# EAGLE design SuperAli (EAGLE 7.2.0)
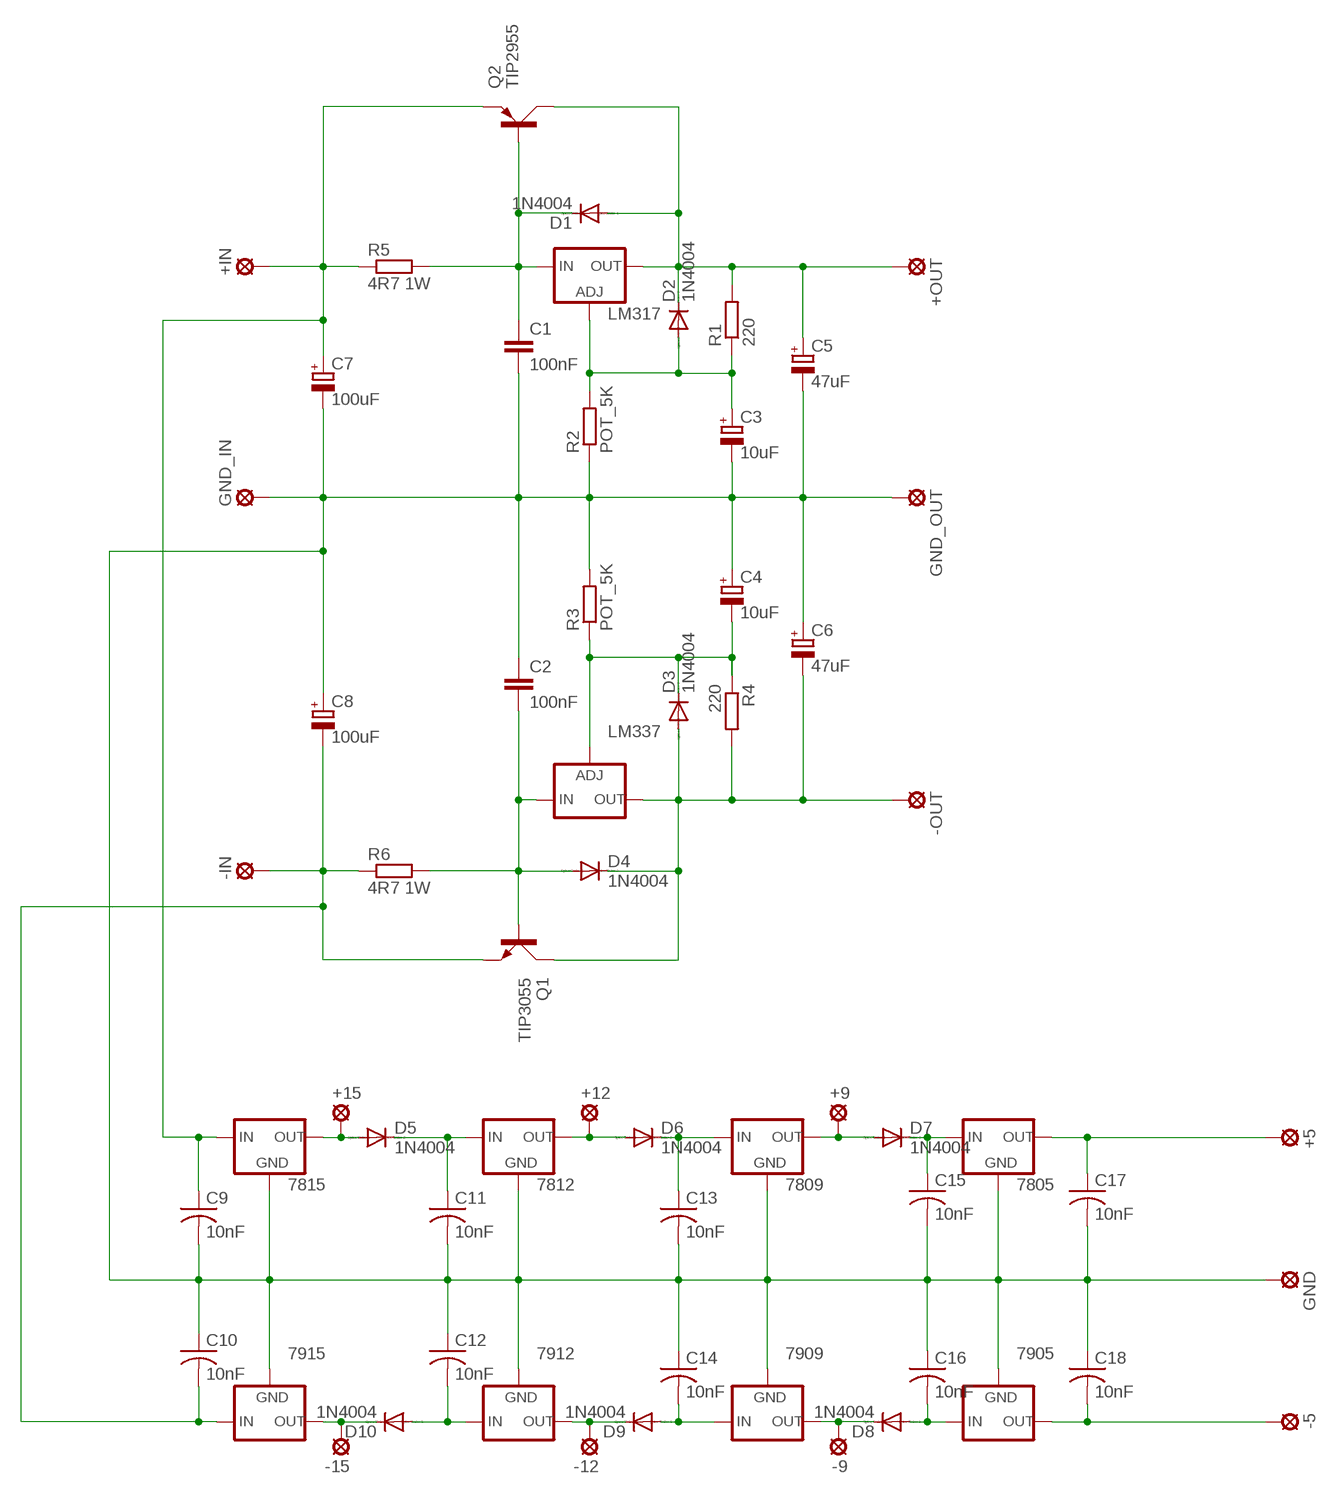
[diagram p0: schematic, sheet 1]

## Parts
7805  78XXS  [78XXS]
7809  78XXS  [78XXS]
7812  78XXS  [78XXS]
7815  78XXS  [78XXS]
7905  79XXS  [79XXS]
7909  79XXS  [79XXS]
7912  79XXS  [79XXS]
7915  79XXS  [79XXS]
+5  LSP10  [LSP10]
+9  LSP10  [LSP10]
+12  LSP10  [LSP10]
+15  LSP10  [LSP10]
+IN  LSP13  [LSP13]
+OUT  LSP13  [LSP13]
-5  LSP10  [LSP10]
-9  LSP10  [LSP10]
-12  LSP10  [LSP10]
-15  LSP10  [LSP10]
-IN  LSP13  [LSP13]
-OUT  LSP13  [LSP13]
C1  100nF  C-EU025-040X050  [C025-040X050]
C2  100nF  C-EU025-040X050  [C025-040X050]
C3  10uF  CPOL-EUE2-5  [E2-5]
C4  10uF  CPOL-EUE2-5  [E2-5]
C5  47uF  CPOL-EUE3.5-10  [E3,5-10]
C6  47uF  CPOL-EUE3.5-10  [E3,5-10]
C7  100uF  CPOL-EUE7.5-16  [E7,5-16]
C8  100uF  CPOL-EUE7.5-16  [E7,5-16]
C9  10nF  C-US025-025X050  [C025-025X050]
C10  10nF  C-US025-025X050  [C025-025X050]
C11  10nF  C-US025-025X050  [C025-025X050]
C12  10nF  C-US025-025X050  [C025-025X050]
C13  10nF  C-US025-025X050  [C025-025X050]
C14  10nF  C-US025-025X050  [C025-025X050]
C15  10nF  C-US025-025X050  [C025-025X050]
C16  10nF  C-US025-025X050  [C025-025X050]
C17  10nF  C-US025-025X050  [C025-025X050]
C18  10nF  C-US025-025X050  [C025-025X050]
D1  1N4004  [DO41-10]
D2  1N4004  [DO41-10]
D3  1N4004  [DO41-10]
D4  1N4004  [DO41-10]
D5  1N4004  [DO41-10]
D6  1N4004  [DO41-10]
D7  1N4004  [DO41-10]
D8  1N4004  [DO41-10]
D9  1N4004  [DO41-10]
D10  1N4004  [DO41-10]
GND  LSP10  [LSP10]
GND_IN  LSP13  [LSP13]
GND_OUT  LSP13  [LSP13]
LM317  LM317TS  [317TS]
LM337  LM337TS  [337TS]
Q1  TIP3055  [TOP3AV]
Q2  TIP2955  [TOP3AV]
R1  220  R-EU_0207/7  [0207/7]
R2  POT_5K  R-EU_0207/7  [0207/7]
R3  POT_5K  R-EU_0207/7  [0207/7]
R4  220  R-EU_0207/7  [0207/7]
R5  4R7 1W  R-EU_0617/17  [0617/17]
R6  4R7 1W  R-EU_0617/17  [0617/17]

## Nets
7809: 7809.OUT +9.MP D7.A
N$2: C3.+ D2.A LM317.1(ADJ) R1.1 R2.2
N$3: C2.2 D4.A LM337.2(IN) Q1.B R6.2
N$4: C4.- D3.C LM337.1(ADJ) R3.1 R4.1
N$5: C1.1 D1.C LM317.3(IN) Q2.B R5.2
N$6: -OUT.MP C6.- D3.A D4.C LM337.3(OUT) Q1.C R4.2
N$7: 7815.IN +IN.MP C7.+ C9.1 Q2.E R5.1
N$8: 7805.GND 7809.GND 7812.GND 7815.GND 7905.GND 7909.GND 7912.GND 7915.GND C1.2 C2.1 C3.- C4.+ C5.- C6.+ C7.- C8.+ C9.2 C10.1 C11.2 C12.1 C13.2 C14.1 C15.2 C16.1 C17.2 C18.1 GND.MP GND_IN.MP GND_OUT.MP R2.1 R3.2
N$9: 7915.IN -IN.MP C8.- C10.2 Q1.E R6.1
N$10: +OUT.MP C5.+ D1.A D2.C LM317.2(OUT) Q2.C R1.2
N$14: 7805.OUT +5.MP C17.1
N$15: 7905.OUT -5.MP C18.2
N$16: 7805.IN C15.1 D7.C
N$17: 7905.IN C16.2 D8.A
N$18: 7909.OUT -9.MP D8.C
N$20: 7809.IN C13.1 D6.C
N$21: 7909.IN C14.2 D9.A
N$22: 7912.OUT -12.MP D9.C
N$23: 7812.OUT +12.MP D6.A
N$24: 7812.IN C11.1 D5.C
N$25: 7815.OUT +15.MP D5.A
N$26: 7915.OUT -15.MP D10.C
N$27: 7912.IN C12.2 D10.A

## Library data of the parts
7805 7809 7812 7815 = v-reg:78XXS: VOLTAGE REGULATOR
7905 7909 7912 7915 = v-reg:79XXS: VOLTAGE REGULATOR
+5 +9 +12 +15 -5 -9 -12 -15 GND = solpad:LSP10: SOLDER PAD drill 1.0 mm, distributor Buerklin, 12H555
+IN +OUT -IN -OUT GND_IN GND_OUT = solpad:LSP13: SOLDER PAD drill 1.3 mm, distributor Buerklin, 12H562
C1 C2 = rcl:C-EU: CAPACITOR, European symbol
C3-C8 = rcl:CPOL-EU: POLARIZED CAPACITOR, European symbol
C9-C18 = rcl:C-US: CAPACITOR, American symbol
D1-D10 = diode:1N4004: DIODE general purpose rectifier, 1 A
LM317 = v-reg:LM317TS: VOLTAGE REGULATOR
LM337 = v-reg:LM337TS: VOLTAGE REGULATOR
Q1 = transistor-power:TIP3055: NPN TRANSISTOR
Q2 = transistor-power:TIP2955: PNP TRANSISTOR
R1-R6 = rcl:R-EU_: RESISTOR, European symbol

## Board
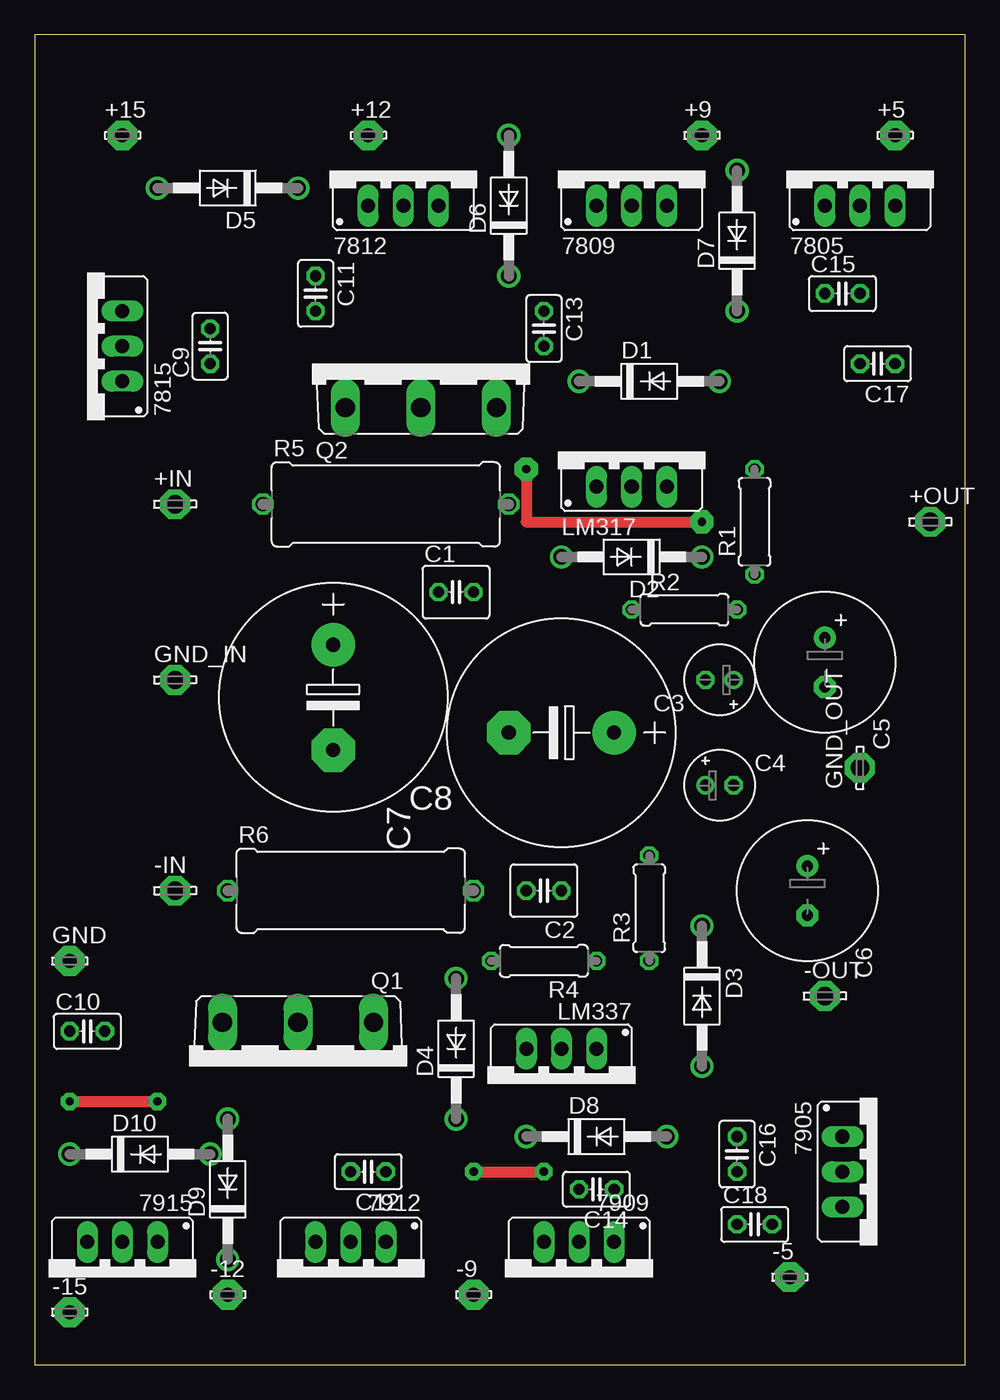
[diagram p1: board, top side]
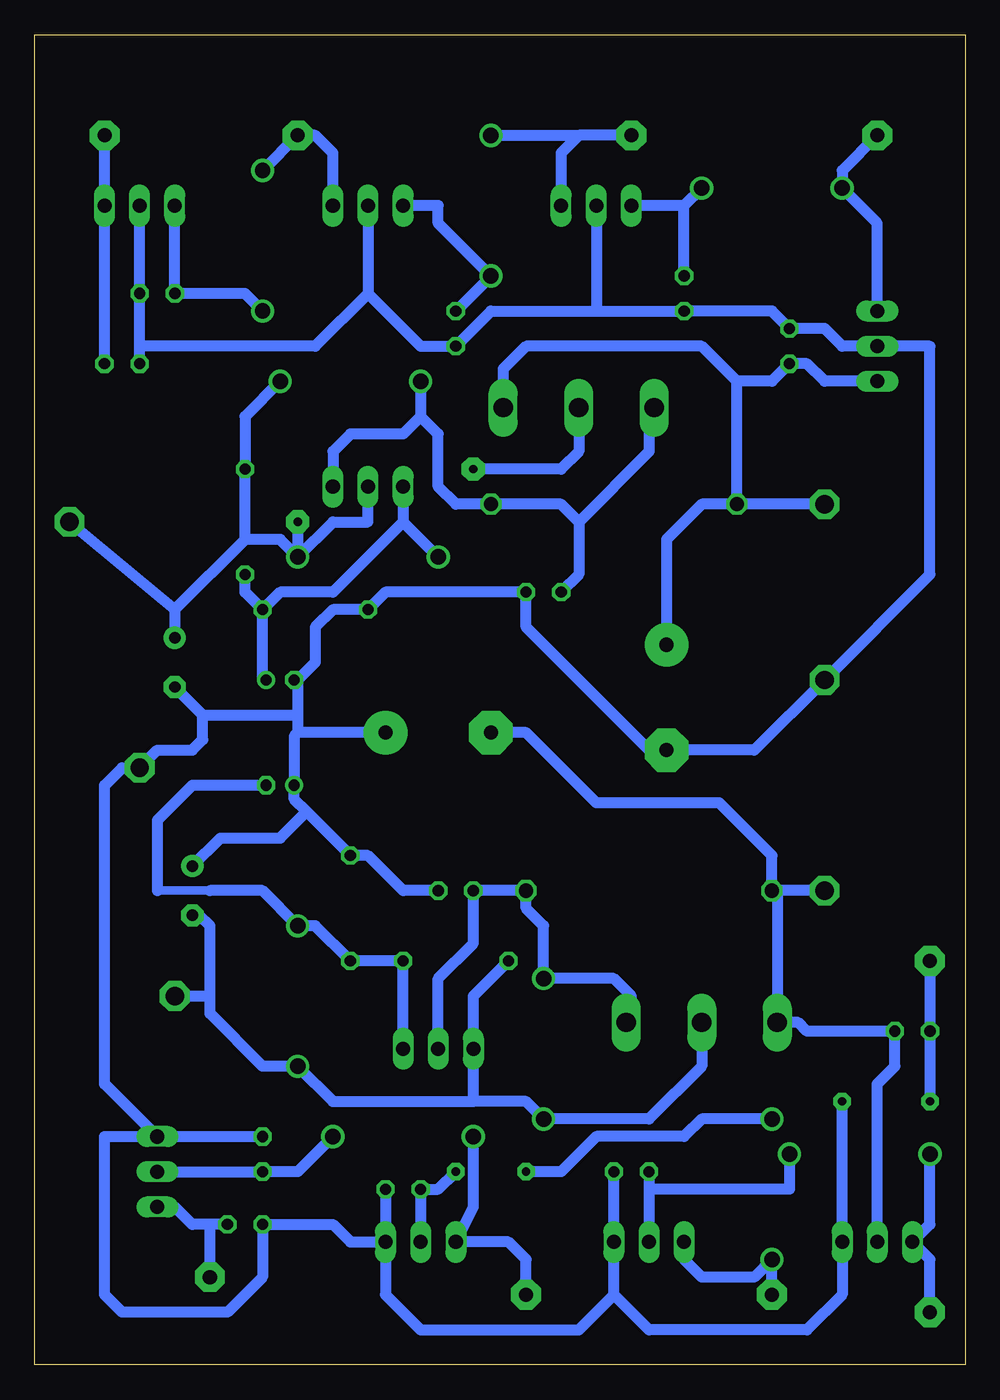
[diagram p2: board, bottom side, seen from below]

Size 67.29 x 96.19 mm. Coordinates in mm from the lower left corner, seen from the top.
Outline: 0,0 67.29,0 67.29,96.19 0,96.19 0,0
Copper layers (1*16): Top 0.035mm / dielectric 1.5mm / Bottom 0.035mm
Design rules "default": minimum track width 10mil, minimum drill 24mil, track to track 8mil, track to pad 8mil, pad to pad 8mil, via to via 8mil, smd to smd 8mil, copper to edge 40mil, drill to drill 8mil, minimum pad ring 10mil, minimum via ring 8mil, stop-mask expansion 4mil, vias tented up to drill 0mil, thermal gap 10mil

### Footprints (pad centres in the part's own frame; a part is rotated, then mirrored left to right if it is on the bottom)
78XXS = drill 1.016 long: GND 0,-2.54; IN -2.54,-2.54; OUT 2.54,-2.54
79XXS = drill 1.016 long: GND -2.54,-2.54; IN 0,-2.54; OUT 2.54,-2.54
LSP10 = drill 1.016 pad 2.159 octagon: MP 0,0
LSP13 = drill 1.321 pad 2.159 octagon: MP 0,0
C025-040X050 = drill 0.813 octagon: 1 -1.27,0; 2 1.27,0
E2-5 = drill 0.813 pad 1.27: + -1.016,0 | drill 0.813 pad 1.27 octagon: - 1.016,0
E3,5-10 = drill 0.813 pad 1.6: + -1.778,0 | drill 0.813 pad 1.6 octagon: - 1.778,0
E7,5-16 = drill 1.016 pad 3.15: + -3.81,0 | drill 1.016 pad 3.15 octagon: - 3.81,0
C025-025X050 = drill 0.813 octagon: 1 -1.27,0; 2 1.27,0
DO41-10 = drill 1.118: A 5.08,0; C -5.08,0
317TS = drill 1.016 long: 1 -2.54,-2.54; 2 0,-2.54; 3 2.54,-2.54
337TS = drill 1.016 long: 1 -2.54,-2.54; 2 0,-2.54; 3 2.54,-2.54
TOP3AV = drill 1.397 long: B -5.461,-3.175; C 0,-3.175; E 5.461,-3.175
0207/7 = drill 0.813 octagon: 1 -3.81,0; 2 3.81,0
0617/17 = drill 1.016 octagon: 1 -8.89,0; 2 8.89,0

### Placement (x,y rotation side)
7805  59.69,86.36 0 top
7809  43.18,86.36 0 top
7812  26.67,86.36 0 top
7815  3.81,73.66 90 top
7905  60.96,13.97 270 top
7909  39.37,6.35 180 top
7912  22.86,6.35 180 top
7915  6.35,6.35 180 top
+5  62.23,88.9 0 top
+9  48.26,88.9 0 top
+12  24.13,88.9 0 top
+15  6.35,88.9 0 top
+IN  10.16,62.23 0 top
+OUT  64.77,60.96 0 top
-5  54.61,6.35 0 top
-9  31.75,5.08 0 top
-12  13.97,5.08 0 top
-15  2.54,3.81 0 top
-IN  10.16,34.29 0 top
-OUT  57.15,26.67 0 top
C1  30.48,55.88 0 top
C2  36.83,34.29 180 top
C3  49.53,49.53 180 top
C4  49.53,41.91 0 top
C5  57.15,50.8 270 top
C6  55.88,34.29 270 top
C7  21.59,48.26 270 top
C8  38.1,45.72 180 top
C9  12.7,73.66 90 top
C10  3.81,24.13 0 top
C11  20.32,77.47 270 top
C12  24.13,13.97 180 top
C13  36.83,74.93 270 top
C14  40.64,12.7 180 top
C15  58.42,77.47 0 top
C16  50.8,15.24 270 top
C17  60.96,72.39 180 top
C18  52.07,10.16 0 top
D1  44.45,71.12 0 top
D2  43.18,58.42 180 top
D3  48.26,26.67 270 top
D4  30.48,22.86 90 top
D5  13.97,85.09 180 top
D6  34.29,83.82 90 top
D7  50.8,81.28 90 top
D8  40.64,16.51 0 top
D9  13.97,12.7 90 top
D10  7.62,15.24 0 top
GND  2.54,29.21 0 top
GND_IN  10.16,49.53 0 top
GND_OUT  59.69,43.18 90 top
LM317  43.18,66.04 0 top
LM337  38.1,20.32 180 top
Q1  19.05,21.59 180 top
Q2  27.94,72.39 0 top
R1  52.07,60.96 90 top
R2  46.99,54.61 0 top
R3  44.45,33.02 90 top
R4  36.83,29.21 180 top
R5  25.4,62.23 0 top
R6  22.86,34.29 0 top

### Tracks (layer width: path | path; a pad name or v marks a point on that pad's centre or on a via)
7809
  Bottom 0.813: D7.A +9.MP 46.99,88.9 45.72,87.63 7809.OUT
N$2
  Bottom 0.813: C3.+ 50.8,49.78 R2.2 | R2.2 52.07,55.88 R1.1 | D2.A 40.64,60.96 | LM317.1 40.64,60.96 | 40.64,60.96 45.72,55.88 49.53,55.88 R2.2
N$3
  Bottom 0.813: Q1.B 24.13,25.15 24.13,26.67 25.4,27.94 D4.A 30.48,31.75 31.75,33.02 R6.2 C2.2 35.56,30.48 38.1,27.94 LM337.2
N$4
  Bottom 0.61: 54.61,34.29 58.42,34.29
  Bottom 0.813: LM337.1 R4.1 R3.1 46.99,31.75 D3.C 50.8,34.29 54.61,34.29 | C4.- 55.88,41.91 58.42,39.37 58.42,34.29
N$5
  Bottom 0.813: Q2.B 22.86,68.83 22.86,66.04 27.94,60.96 | 27.94,60.96 27.94,57.15 C1.1 | 27.94,60.96 29.21,62.23 R5.2 36.83,62.23 38.1,63.5 38.1,67.31 39.37,68.58 | D1.C 39.37,68.58 | 39.37,68.58 40.64,67.31 44.45,67.31 45.72,66.04 LM317.3
N$6
  Bottom 0.813: Q1.C 19.05,21.59 22.86,17.78 D4.C 31.75,19.05 35.56,19.05 | 35.56,19.05 LM337.3 35.56,26.67 R4.2 | 35.56,19.05 45.72,19.05 D3.A 50.8,21.59 54.61,25.4 54.61,26.67 | 54.61,26.67 54.61,31.75 55.37,32.51 C6.- | -OUT.MP 54.61,26.67
N$7
  Bottom 0.813: +IN.MP R5.1 | R5.1 19.05,62.23 21.59,59.69 C7.+ | R5.1 16.51,71.12 | 16.51,71.12 19.05,73.66 31.75,73.66 33.4,72.01 Q2.E | 7815.IN 10.16,71.12 11.43,72.39 C9.1 13.97,71.12 16.51,71.12
N$8  (via drill 0.6 pad 1.27)
  Top 0.813: v2.54,19.05 v8.89,19.05
  Bottom 0.813: C2.1 40.64,34.29 43.18,36.83 R3.2 47.62,40 | 47.62,40 48.51,40.89 C4.+ 48.51,45.47 48.26,45.72 | C8.+ 48.26,45.72 | 48.26,46.99 48.26,49.28 C3.- 48.26,49.53 46.99,50.8 46.99,53.34 45.72,54.61 R2.1 41.91,55.88 C1.2 31.75,53.34 22.86,44.45 C7.- 15.24,44.45 GND_IN.MP 2.54,57.15 2.54,73.66 7815.GND 8.89,73.66 10.16,74.93 C9.2 13.97,76.2 C11.2 26.67,76.2 | 48.26,46.99 48.26,45.72 | C6.+ 53.85,38.1 49.53,38.1 47.62,40 | C5.- 55.12,46.99 | 55.12,46.99 48.26,46.99 | 26.67,76.2 34.29,76.2 C13.2 39.37,73.66 43.18,77.47 | 7812.GND 26.67,76.2 | C17.2 59.69,73.66 | 59.69,73.66 C15.2 7805.GND | 7809.GND 43.18,77.47 | 43.18,77.47 46.99,73.66 59.69,73.66 | 7905.GND C16.1 | 55.12,46.99 55.12,45.21 55.88,44.45 58.42,44.45 GND_OUT.MP 60.96,43.18 62.23,41.91 62.23,20.32 7905.GND | C14.1 7909.GND | 7905.GND 62.23,16.51 62.23,5.08 60.96,3.81 53.34,3.81 50.8,6.35 C18.1 45.72,10.16 44.45,8.89 7909.GND | C12.1 7912.GND 25.4,5.08 | 7909.GND 41.91,5.08 39.37,2.54 27.94,2.54 25.4,5.08 | 25.4,5.08 22.86,2.54 11.43,2.54 8.89,5.08 7915.GND v8.89,19.05 | GND.MP C10.1 v2.54,19.05
N$9
  Bottom 0.813: -IN.MP R6.1 | R6.1 13.59,33.91 Q1.E 12.07,24.76 11.43,24.13 C10.2 5.08,21.59 6.35,20.32 7915.IN | R6.1 13.97,36.83 17.78,40.64 26.67,40.64 31.75,45.72 C8.-
N$10  (via drill 0.6 pad 1.68)
  Top 0.813: v35.56,64.77 35.56,60.96 v48.26,60.96
  Bottom 0.813: D1.A 52.07,68.58 R1.2 52.07,59.69 | +OUT.MP 57.15,54.61 | 57.15,54.61 C5.+ 57.15,53.34 | D2.C 49.53,59.69 52.07,59.69 | 52.07,59.69 57.15,54.61 | D2.C 45.72,60.96 43.18,60.96 LM317.2 | Q2.C 27.94,66.04 29.21,64.77 v35.56,64.77 | v48.26,60.96 D2.C
N$14
  Bottom 0.813: C17.1 7805.OUT +5.MP
N$15
  Bottom 0.813: C18.2 54.61,10.16 | 54.61,10.16 55.88,10.16 57.15,11.43 7905.OUT | -5.MP 54.61,10.16
N$16
  Bottom 0.813: D7.C 52.07,77.47 C15.1 7805.IN
N$17
  Bottom 0.813: 7905.IN C16.2 48.26,13.97 D8.A
N$18
  Bottom 0.813: -9.MP 31.75,7.62 33.02,8.89 7909.OUT 35.56,11.43 D8.C
N$20
  Bottom 0.813: 7809.IN 38.1,83.82 38.1,82.55 D6.C C13.1
N$21  (via drill 0.6 pad 1.27)
  Top 0.813: v31.75,13.97 v36.83,13.97
  Bottom 0.813: 7909.IN C14.2 38.1,12.7 v36.83,13.97 | D9.A 19.05,17.78 20.32,16.51 26.67,16.51 29.21,13.97 v31.75,13.97
N$22
  Bottom 0.813: -12.MP D9.C 15.24,6.35 19.05,6.35 20.32,7.62 7912.OUT
N$23
  Bottom 0.813: +12.MP 27.94,88.9 | 27.94,88.9 29.21,87.63 7812.OUT | D6.A 27.94,88.9
N$24
  Bottom 0.813: D5.C 20.32,83.82 | 20.32,83.82 7812.IN | C11.1 20.32,83.82
N$25
  Bottom 0.813: 7815.OUT 6.35,82.55 D5.A 8.89,86.36 +15.MP
N$26
  Bottom 0.813: -15.MP 2.54,7.62 7915.OUT 2.54,10.16 D10.C
N$27
  Bottom 0.813: C12.2 22.86,12.7 | 22.86,12.7 7912.IN | D10.A 12.7,12.7 22.86,12.7